# Altium project COMS0005_Coms_Test_Board.PrjPCB
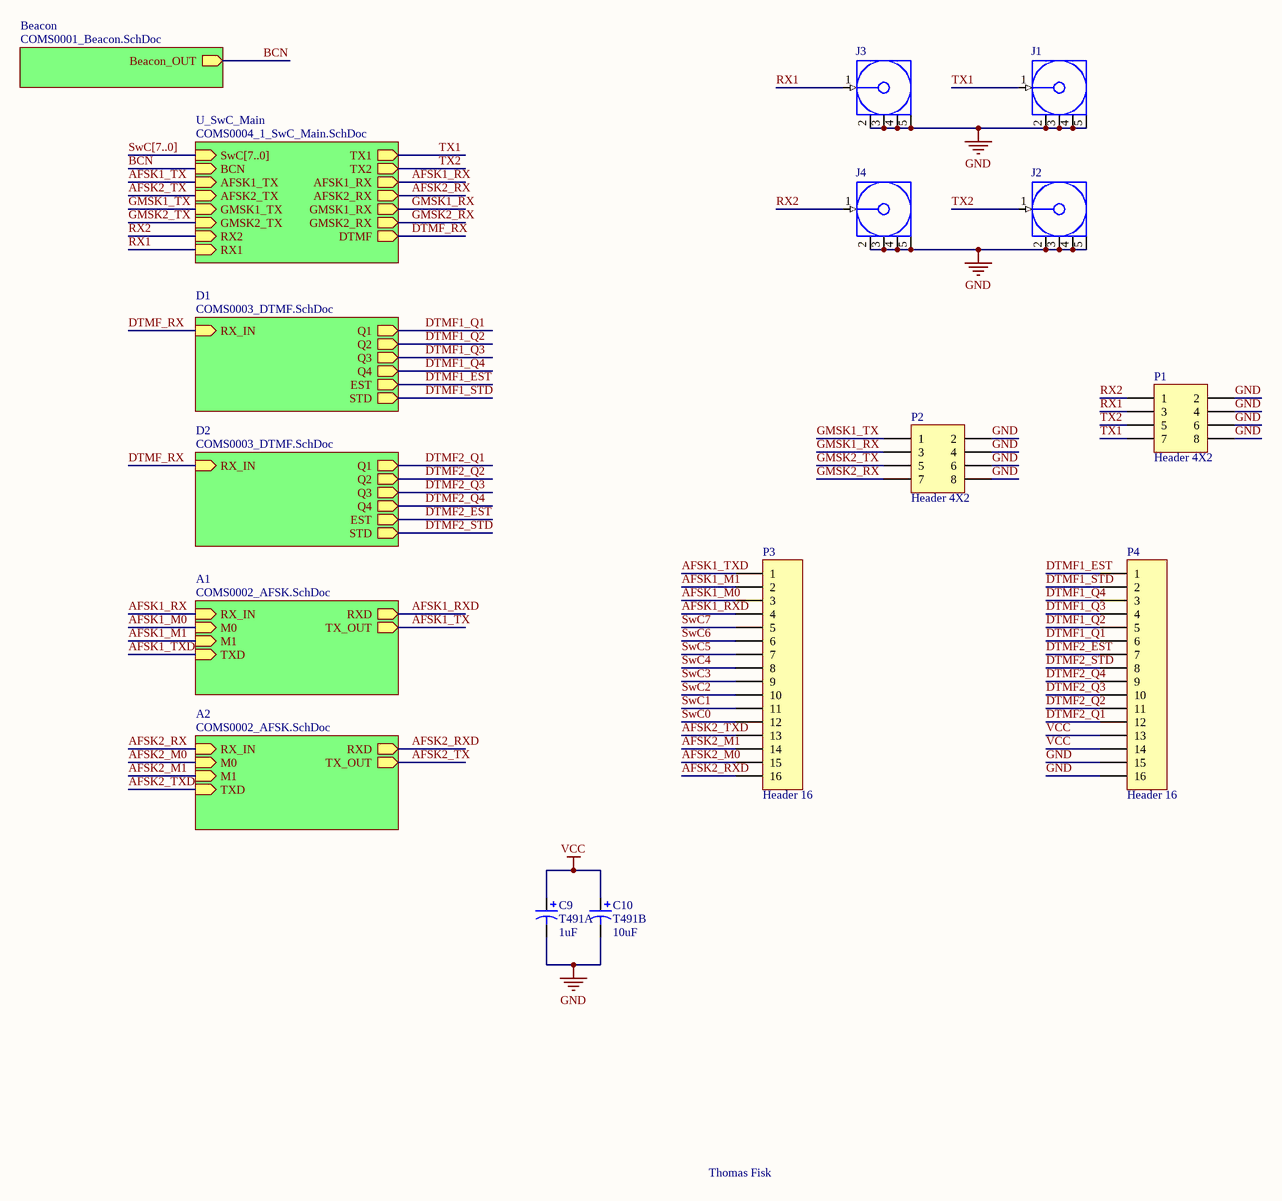
[diagram p0: COMS0005_Comms_Test_Board.SchDoc]
8 sheets, 74 parts. Net scope: hierarchical (ports join the sheet entries above them; power ports are global).
Board file: COMS0005_Coms_Test_Board.PcbDoc
Sheets:
  COMS0005_Comms_Test_Board.SchDoc
    Beacon = COMS0001_Beacon.SchDoc
    D1 = COMS0003_DTMF.SchDoc
    D2 = COMS0003_DTMF.SchDoc
    A1 = COMS0002_AFSK.SchDoc
    A2 = COMS0002_AFSK.SchDoc
    U_SwC_Main = COMS0004_1_SwC_Main.SchDoc
      U_ModemRXMux = COMS0004_4_ModemRXMux.SchDoc
      U_TXDevMux = COMS0004_2_TXDevMux.SchDoc
      U_RadioMux = COMS0004_3_RadioMux.SchDoc

## Sheet COMS0005_Comms_Test_Board.SchDoc: BLUEsat Communications Test Board
size A3; DrawnBy: Thomas Fisk; Engineer: T. FISK; Organization: BLUEsat Project; Address1: Room 419; Address2: School of EE&T; Address3: UNSW, NSW 2052; Address4: Australia; DocumentNumber: COMS0005; SheetNumber: 1; SheetTotal: 1; Description: Test board for communications subsystem.; Version: 1.0

### Parts
C9  T491A  value 1uF  [A]
C10  T491B  value 10uF  [B]
J1  TX1  [SMB_V-RJ45]  (value not drawn)
J2  TX2  [SMB_V-RJ45]  (value not drawn)
J3  RX2  [SMB_V-RJ45]  (value not drawn)
J4  RX1  [SMB_V-RJ45]  (value not drawn)
P1  Header 4X2  [HDR2X4]
P2  Header 4X2  [HDR2X4]
P3  Header 16  [HDR1X16]
P4  Header 16  [HDR1X16]

### Sub-sheets
A1 = COMS0002_AFSK.SchDoc: RX_IN (in), M0 (in), M1 (in), TXD (in), RXD (out), TX_OUT (out)
A2 = COMS0002_AFSK.SchDoc: RX_IN (in), M0 (in), M1 (in), TXD (in), RXD (out), TX_OUT (out)
Beacon = COMS0001_Beacon.SchDoc: Beacon_OUT (out)
D1 = COMS0003_DTMF.SchDoc: RX_IN (in), STD (out), EST (out), Q1 (out), Q2 (out), Q3 (out), Q4 (out)
D2 = COMS0003_DTMF.SchDoc: RX_IN (in), STD (out), EST (out), Q1 (out), Q2 (out), Q3 (out), Q4 (out)
U_SwC_Main = COMS0004_1_SwC_Main.SchDoc: SwC[7..0] (in), BCN (in), AFSK1_TX (in), AFSK2_TX (in), GMSK1_TX (in), GMSK2_TX (in), TX1 (out), TX2 (out), RX2 (in), RX1 (in), AFSK1_RX (out), AFSK2_RX (out), GMSK1_RX (out), GMSK2_RX (out), DTMF (out)

### Nets
GND: C9.2 C10.2 J1.2(GND) J1.3(GND) J1.4(GND) J1.5(GND) J2.2(GND) J2.3(GND) J2.4(GND) J2.5(GND) J3.2(GND) J3.3(GND) J3.4(GND) J3.5(GND) J4.2(GND) J4.3(GND) J4.4(GND) J4.5(GND) P1.2 P1.4 P1.6 P1.8 P2.2 P2.4 P2.6 P2.8 P4.15 P4.16
VCC: C9.1 C10.1 P4.13 P4.14
AFSK1_M0: P3.3 ; sheet A1/M0
AFSK1_M1: P3.2 ; sheet A1/M1
AFSK1_RX: sheet A1/RX_IN, sheet U_SwC_Main/AFSK1_RX
AFSK1_RXD: P3.4 ; sheet A1/RXD
AFSK1_TX: sheet A1/TX_OUT, sheet U_SwC_Main/AFSK1_TX
AFSK1_TXD: P3.1 ; sheet A1/TXD
AFSK2_M0: P3.15 ; sheet A2/M0
AFSK2_M1: P3.14 ; sheet A2/M1
AFSK2_RX: sheet A2/RX_IN, sheet U_SwC_Main/AFSK2_RX
AFSK2_RXD: P3.16 ; sheet A2/RXD
AFSK2_TX: sheet A2/TX_OUT, sheet U_SwC_Main/AFSK2_TX
AFSK2_TXD: P3.13 ; sheet A2/TXD
BCN: sheet Beacon/Beacon_OUT, sheet U_SwC_Main/BCN  [project net AF]
DTMF1_EST: P4.1 ; sheet D1/EST
DTMF1_Q1: P4.6 ; sheet D1/Q1
DTMF1_Q2: P4.5 ; sheet D1/Q2
DTMF1_Q3: P4.4 ; sheet D1/Q3
DTMF1_Q4: P4.3 ; sheet D1/Q4
DTMF1_STD: P4.2 ; sheet D1/STD
DTMF2_EST: P4.7 ; sheet D2/EST
DTMF2_Q1: P4.12 ; sheet D2/Q1
DTMF2_Q2: P4.11 ; sheet D2/Q2
DTMF2_Q3: P4.10 ; sheet D2/Q3
DTMF2_Q4: P4.9 ; sheet D2/Q4
DTMF2_STD: P4.8 ; sheet D2/STD
DTMF_RX: sheet D1/RX_IN, sheet D2/RX_IN, sheet U_SwC_Main/DTMF
GMSK1_RX: P2.3 ; sheet U_SwC_Main/GMSK1_RX
GMSK1_TX: P2.1 ; sheet U_SwC_Main/GMSK1_TX
GMSK2_RX: P2.7 ; sheet U_SwC_Main/GMSK2_RX
GMSK2_TX: P2.5 ; sheet U_SwC_Main/GMSK2_TX
RX1: J3.1(Signal) P1.3 ; sheet U_SwC_Main/RX1
RX2: J4.1(Signal) P1.1 ; sheet U_SwC_Main/RX2
SwC0: P3.12
SwC1: P3.11
SwC2: P3.10
SwC3: P3.9
SwC4: P3.8
SwC5: P3.7
SwC6: P3.6
SwC7: P3.5
TX1: J1.1(Signal) P1.7 ; sheet U_SwC_Main/TX1
TX2: J2.1(Signal) P1.5 ; sheet U_SwC_Main/TX2

### Buses and harness runs
bus SwC[7..0] = sheet U_SwC_Main/SwC[7..0]

### Notes on the sheet
- Thomas Fisk
- Title
- Description:
- Size:
- Author:
- Date:
- A3
- Time:
- Version
- Sheet:
- Drawing No.:
- of
- File:

### Library data of the parts
C9 = T491A: Solid Tantalum Chip Capacitor, Standard T491 Series - Industrial Grade; Published: 17-Jul-2002; LatestRevisionDate: 19-Mar-2004; LatestRevisionNote: Silkscreen dimensions re-sized.; DatasheetDocument: Mar-2001; PackageDocument: Mar-2001; PackageReference: A; Publisher: Altium Limited; Code_JEITA: 3216-18; ComponentLink1Description: Manufacturer Link; ComponentLink1URL: http://www.kemet.com/; ComponentLink2Description: Datasheet; ComponentLink2URL: http://www.kemet.com/kemet/web/homepage/kechome.nsf/vapubfilesname/F3102TA.pdf/$file/F3102TA.pdf
C10 = T491B: Solid Tantalum Chip Capacitor, Standard T491 Series - Industrial Grade; Published: 17-Jul-2002; LatestRevisionDate: 19-Mar-2004; LatestRevisionNote: Silkscreen dimensions re-sized.; DatasheetDocument: Mar-2001; PackageDocument: Mar-2001; PackageReference: B; Publisher: Altium Limited; Code_JEITA: 3528-21; ComponentLink1Description: Manufacturer Link; ComponentLink1URL: http://www.kemet.com/; ComponentLink2Description: Datasheet; ComponentLink2URL: http://www.kemet.com/kemet/web/homepage/kechome.nsf/vapubfilesname/F3102TA.pdf/$file/F3102TA.pdf
J1-J4 = COAX-F: RF Coaxial PCB Connector, MCX; Thru-Hole, Right-Angle Mount Socket, Blunt Post Terminal, 50 Ohm Impedance; pin to pad: 3>2 4>2 5>2; PCB_Layout: Complies with manufacturer's recommendation.; DrillSize: Corresponds to nominal value.; Published: 15-Jul-2004; LatestRevisionDate: 15-Jul-2004; LatestRevisionNote: Component Replaced.; DatasheetDocument: 30-May-2003; PackageDocument: 04-Jul-1999; PackageReference: 919-119J-51AX; Publisher: Altium Limited; ComponentLink1Description: Manufacturer Link; ComponentLink1URL: http://www.amphenolrf.com/
P1 P2 = Header 4X2: Header, 4-Pin, Dual row; LatestRevisionDate: 17-Jul-2002; LatestRevisionNote: Re-released for DXP Platform.; Publisher: Altium Limited
P3 P4 = Header 16: Header, 16-Pin; LatestRevisionDate: 17-Jul-2002; LatestRevisionNote: Re-released for DXP Platform.; Publisher: Altium Limited

## Sheet COMS0001_Beacon.SchDoc: BLUEsat Beacon
size A3; Author: Daniel Jedrychowski; Engineer: D. JEDRYCHOWSKI; Organization: BLUEsat Project; Address1: Room 419; Address2: School of EE&T; Address3: UNSW, NSW 2052; Address4: Australia; DocumentNumber: COMS0001; SheetNumber: 1; SheetTotal: 1; Description: Morse code continuous wave beacon based on EPROM; Version: 1.1
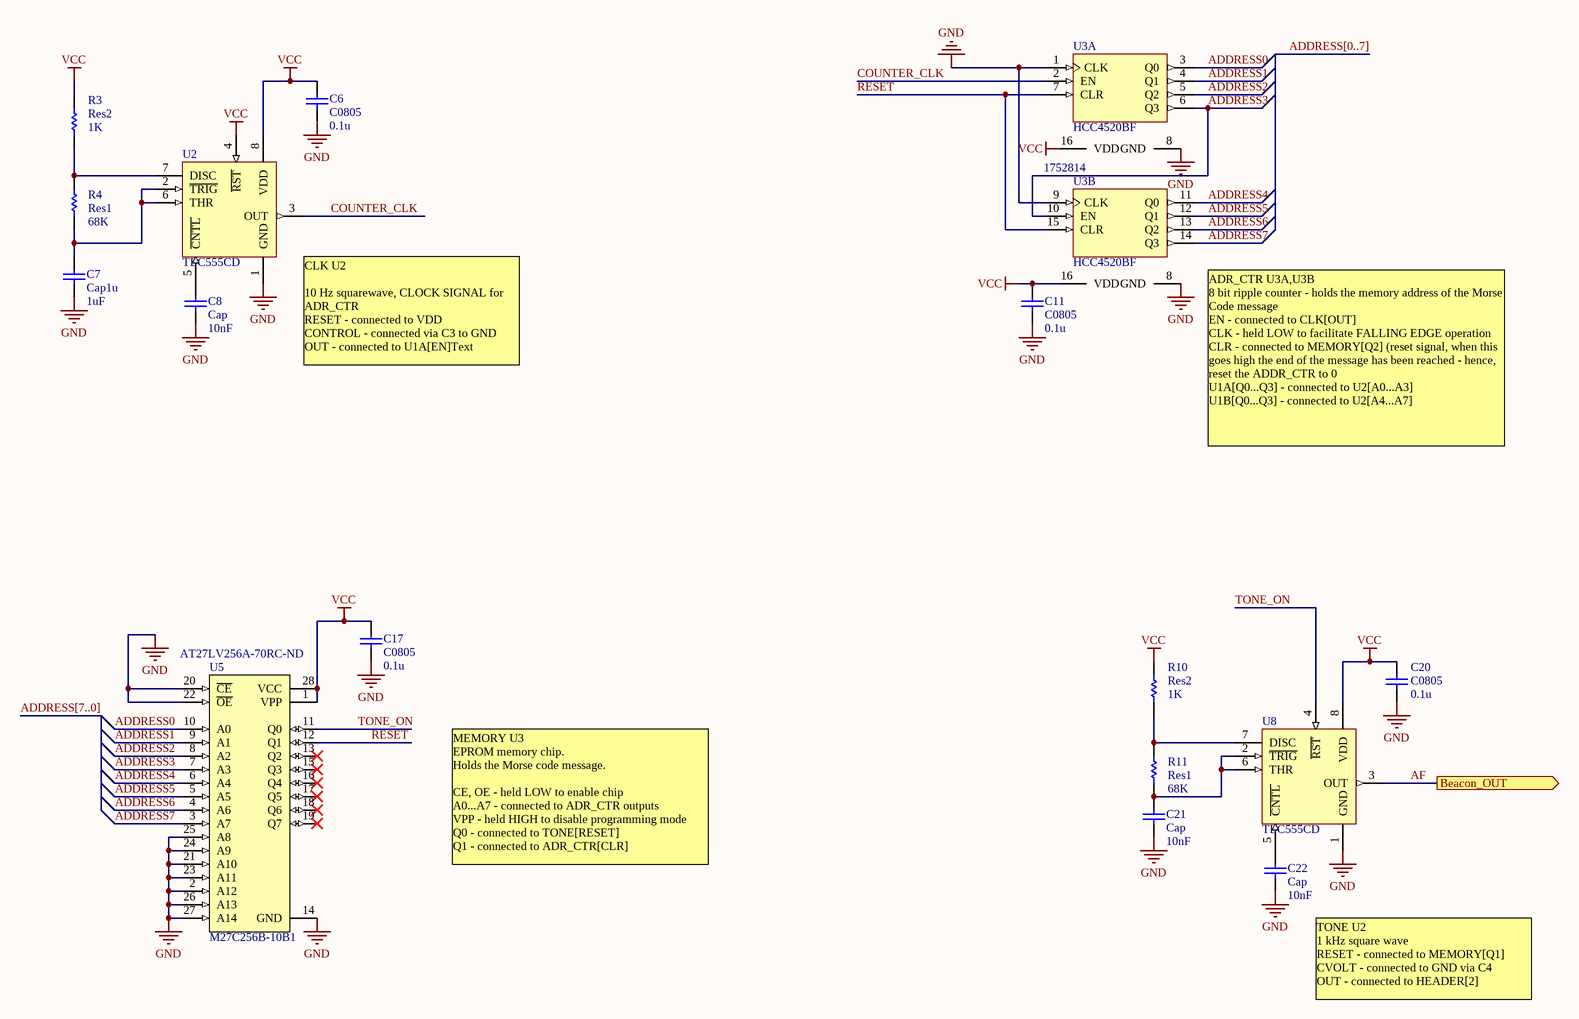
[diagram p1: COMS0001_Beacon.SchDoc]

### Parts
C6  C0805  value 0.1u  [CAPC2012M]
C7  Cap1u  value 1uF  [CAPC2012M]
C8  Cap  value 10nF  [CAPC2012M]
C11  C0805  value 0.1u  [CAPC2012M]
C17  C0805  value 0.1u  [CAPC2012M]
C20  C0805  value 0.1u  [CAPC2012M]
C21  Cap  value 10nF  [CAPC2012M]
C22  Cap  value 10nF  [CAPC2012M]
R3  Res2  value 1K  [RESC2012M]
R4  Res1  value 68K  [RESC2012M]
R10  Res2  value 1K  [RESC2012M]
R11  Res1  value 68K  [RESC2012M]
U2  TLC555CD  [D008_M]
U3  HCC4520BF  [SOIC16_M]  (parts A,B of 2)
U5  M27C256B-10B1  Supplier Part Number 1: AT27LV256A-70RC-ND  [SOIC127P1199-28AM]
U8  TLC555CD  [D008_M]

### Ports
Beacon_OUT (out)

### Nets
GND: C6.1 C7.1 C8.1 C11.1 C17.1 C20.1 C21.1 C22.1 U2.1(GND) U3.1(CLK) U3.8(GND) U3.9(CLK) U5.2(A12) U5.14(GND) U5.20(~{CE}) U5.21(A10) U5.22(~{OE}) U5.23(A11) U5.24(A9) U5.25(A8) U5.26(A13) U5.27(A14) U8.1(GND)
VCC: C6.2 C11.2 C17.2 C20.2 R3.2 R10.2 U2.4(~{RST}) U2.8(VDD) U3.16(VDD) U5.1(VPP) U5.28(VCC) U8.8(VDD)
ADDRESS0: U3.3(Q0) U5.10(A0)
ADDRESS1: U3.4(Q1) U5.9(A1)
ADDRESS2: U3.5(Q2) U5.8(A2)
ADDRESS3: U3.6(Q3) U3.10(EN) U5.7(A3)
ADDRESS4: U3.11(Q0) U5.6(A4)
ADDRESS5: U3.12(Q1) U5.5(A5)
ADDRESS6: U3.13(Q2) U5.4(A6)
ADDRESS7: U3.14(Q3) U5.3(A7)
AF: U8.3(OUT) ; port Beacon_OUT
COUNTER_CLK: U2.3(OUT) U3.2(EN)
RESET: U3.7(CLR) U3.15(CLR) U5.12(Q1)
TONE_ON: U5.11(Q0) U8.4(~{RST})
NetC7_2: C7.2 R4.1 U2.2(~{TRIG}) U2.6(THR)
NetC8_2: C8.2 U2.5(~{CNTL})
NetC21_2: C21.2 R11.1 U8.2(~{TRIG}) U8.6(THR)
NetC22_2: C22.2 U8.5(~{CNTL})
NetR3_1: R3.1 R4.2 U2.7(DISC)
NetR10_1: R10.1 R11.2 U8.7(DISC)

Not connected (* = marked no-connect by the designer): U5 13(Q2)* 15(Q3)* 16(Q4)* 17(Q5)* 18(Q6)* 19(Q7)*

### Buses and harness runs
bus ADDRESS[0..7]
bus ADDRESS[7..0]

### Notes on the sheet
- (near U2) CLK U2
  10 Hz squarewave, CLOCK SIGNAL for ADR_CTR
  RESET - connected to VDD
  CONTROL - connected via C3 to GND
  OUT - connected to U1A[EN]Text
- (near U3) ADR_CTR U3A,U3B
  8 bit ripple counter - holds the memory address of the Morse Code message
  EN - connected to CLK[OUT]
  CLK - held LOW to facilitate FALLING EDGE operation
  CLR - connected to MEMORY[Q2] (reset signal, when this goes high the end of the message has been reached - hence, reset the ADDR_CTR to 0
  U1A[Q0...Q3] - connected to U2[A0...A3]
  U1B[Q0...Q3] - connected to U2[A4...A7]
- MEMORY U3
  EPROM memory chip.
  Holds the Morse code message.
  CE, OE - held LOW to enable chip
  A0...A7 - connected to ADR_CTR outputs
  VPP - held HIGH to disable programming mode
  Q0 - connected to TONE[RESET]
  Q1 - connected to ADR_CTR[CLR]
- TONE U2
  1 kHz square wave
  RESET - connected to MEMORY[Q1]
  CVOLT - connected to GND via C4
  OUT - connected to HEADER[2]
- Title
- Description:
- Size:
- Author:
- Date:
- A3
- Time:
- Version
- Sheet:
- Drawing No.:
- of
- File:

### Library data of the parts
C6-C8 C11 C17 C20-C22 = Cap: Capacitor; Published: 8-Jun-2000; LatestRevisionDate: 17-Jul-2002; LatestRevisionNote: Re-released for DXP Platform.; PackageReference: RAD-0.3; Publisher: Altium Limited; Supplier 1: Farnell
  C6 C11 C17 C20: Supplier Part Number 1: 1650866
  C7: Supplier Part Number 1: 1637035
  C8 C21 C22: Supplier Part Number 1: 9406352
R3 R4 R10 R11 = Res1: Resistor; Published: 8-Jun-2000; LatestRevisionDate: 17-Jul-2002; LatestRevisionNote: Re-released for DXP Platform.; PackageReference: AXIAL-0.3; Publisher: Altium Limited; Supplier 1: Farnell
  R3 R10: Supplier Part Number 1: 1500663
  R4 R11: Supplier Part Number 1: 9234233
U2 U8 = TLC555CD: LinCMOS Timer; Published: 15-Apr-2002; LatestRevisionDate: 13-Apr-2006; LatestRevisionNote: IPC-7351 Footprint Added.; DatasheetVersion: Oct-1988; PackageVersion: Jan-1998; PackageReference: D008; Publisher: Altium Limited; PackageDescription: 8-Pin Small Outline Integrated Circuit 1.27 mm Pitch; Code_IPC: SOIC127P600-8; ComponentLink1Description: Manufacturer Link; ComponentLink1URL: http://www.ti.com/; ComponentLink2Description: Datasheet; ComponentLink2URL: http://www-s.ti.com/sc/ds/tlc555.pdf; Supplier 1: Farnell; Supplier Part Number 1: 1575195
  U2: Supplier 2: Farnell
  U8: Supplier 2: Mouser
U3 = HCC4520BF: Dual Binary Up-Counter; Published: 8-Jun-2000; LatestRevisionDate: 06-Jun-2005; LatestRevisionNote: Stylized 3D Model Added.; DatasheetVersion: Jun-1989; PackageVersion: Apr-1996; PackageReference: DIP16; Publisher: Altium Limited; PackageDescription: DIP; 16 Leads; Row Spacing 7.62 mm; Pitch 2.54 mm; ComponentLink1Description: Manufacturer Link; ComponentLink1URL: http://www.st.com/; Supplier 1: Farnell; Supplier Part Number 1: 1752814; Supplier 2: Farnell
U5 = M27C256B-10B1: 256 Kbit (32Kb X 8) UV EPROM and OTP EPROM; Published: 24-Aug-2001; LatestRevisionDate: 06-Jun-2005; LatestRevisionNote: Stylized 3D Model Added.; DatasheetVersion: Jul-1998; PackageVersion: Jan-2003; PackageReference: PDIP28; Publisher: Altium Limited; PackageDescription: DIP; 28 Leads; Row Spacing 15.24 mm; Pitch 2.54 mm; ComponentLink1Description: Manufacturer Link; ComponentLink1URL: http://www.st.com/; ComponentLink2Description: Datasheet; ComponentLink2URL: http://www.st.com/stonline/products/literature/ds/2384/m27c256b.pdf; Supplier 1: Digi-Key

## Sheet COMS0003_DTMF.SchDoc: BLUEsat DTMF receiver
size A3; DrawnBy: Thomas Fisk; Engineer: T. FISK; Organization: BLUEsat Project; Address1: Room 419; Address2: School of EE&T; Address3: UNSW, NSW 2052; Address4: Australia; DocumentNumber: COMS0003; SheetNumber: 1; SheetTotal: 1; Description: DTMF Reciever based on Zarlink MT88L70 IC; Version: 1.0
Used 2 times, as channels D1, D2. Parts and nets are listed once, with the designators drawn on the sheet.
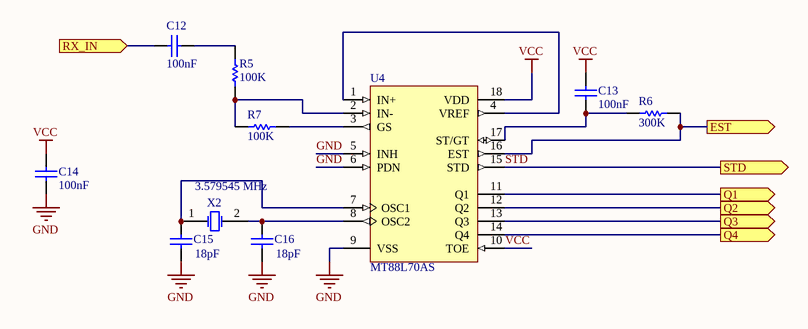
[diagram p2: COMS0003_DTMF.SchDoc]

### Parts
C12  value 100nF  [CAPC2012M]  (hidden comment: Cap)
C13  value 100nF  [CAPC2012M]  (hidden comment: Cap)
C14  value 100nF  [CAPC2012M]  (hidden comment: Cap)
C15  value 18pF  [CAPC2012M]  (hidden comment: Cap)
C16  value 18pF  [CAPC2012M]  (hidden comment: Cap)
R5  value 100K  [RESC2012M]  (hidden comment: Res1)
R6  value 300K  [RESC2012M]  (hidden comment: Res1)
R7  value 100K  [RESC2012M]  (hidden comment: Res1)
U4  MT88L70AS  [SOIC18_N]
X2  3.579545 MHz  [CSM-7]

### Ports
EST (out), Q1 (out), Q2 (out), Q3 (out), Q4 (out), RX_IN (in), STD (out)

### Nets
GND: C14.2 C15.2 C16.2 U4.5(INH) U4.6(PDN) U4.9(VSS)
VCC: C13.2 C14.1 U4.10(TOE) U4.18(VDD)
EST: R6.1 U4.16(EST) ; port EST
Q1: U4.11(Q1) ; port Q1
Q2: U4.12(Q2) ; port Q2
Q3: U4.13(Q3) ; port Q3
Q4: U4.14(Q4) ; port Q4
RX_IN: C12.2 ; port RX_IN
STD: U4.15(STD) ; port STD
NetC12_1: C12.1 R5.2
NetC13_1: C13.1 R6.2 U4.17(ST/GT)
NetC15_1: C15.1 U4.7(OSC1) X2.1(OSC1)
NetC16_1: C16.1 U4.8(OSC2) X2.2(OSC2)
NetR5_1: R5.1 R7.2 U4.2(IN-)
NetR7_1: R7.1 U4.3(GS)
NetU4_1: U4.1(IN+) U4.4(VREF)

### Channels
D1: designators end in _D1; ports EST=DTMF1_EST Q1=DTMF1_Q1 Q2=DTMF1_Q2 Q3=DTMF1_Q3 Q4=DTMF1_Q4 RX_IN=DTMF_RX STD=DTMF1_STD
D2: designators end in _D2; ports EST=DTMF2_EST Q1=DTMF2_Q1 Q2=DTMF2_Q2 Q3=DTMF2_Q3 Q4=DTMF2_Q4 RX_IN=DTMF_RX STD=DTMF2_STD

### Notes on the sheet
- Title
- Description:
- Size:
- Author:
- Date:
- A3
- Time:
- Version
- Sheet:
- Drawing No.:
- of
- File:

### Library data of the parts
C12-C16 = Cap: Capacitor; Published: 8-Jun-2000; LatestRevisionDate: 17-Jul-2002; LatestRevisionNote: Re-released for DXP Platform.; PackageReference: RAD-0.3; Publisher: Altium Limited; PackageDescription: Radial Cap, Thru-Hole; 2 Leads; 0.3 in Pin Spacing; Supplier 1: Farnell; Supplier Part Number 1: 1759143
R5-R7 = Res1: Resistor; Published: 8-Jun-2000; LatestRevisionDate: 17-Jul-2002; LatestRevisionNote: Re-released for DXP Platform.; PackageReference: AXIAL-0.3; Publisher: Altium Limited; PackageDescription: Axial Device, Thru-Hole; 2 Leads; 0.3 in Pin Spacing; Supplier 1: Farnell
  R5 R7: Supplier Part Number 1: 1759143RL; Supplier 2: Farnell; Supplier Part Number 2: 1887334
  R6: Supplier Part Number 1: 1887346
U4 = MT88L70AS: 3 Volt Integrated DTMF Receiver; Published: 8-Jun-2000; LatestRevisionDate: 13-Apr-2006; LatestRevisionNote: IPC-7351 Footprint Added.; DatasheetVersion: Issue 4 March 1997; PackageVersion: 1997; PackageReference: SOIC18; Publisher: Altium Limited; PackageDescription: 18-Pin Small Outline Integrated Circuit 1.27 mm Pitch; Code_JEDEC: MS-013-AB; ComponentLink1Description: Manufacturer Link; ComponentLink1URL: http://products.zarlink.com; ComponentLink2Description: Datasheet; ComponentLink2URL: http://assets.zarlink.com/DS/zarlink_MT88L70_MAY_05.pdf; Supplier 1: Allied; Supplier Part Number 1: 090-SPEC
X2 = ECS-110-S-5P: Crystal Oscillator; Published: 17-Jul-2002; DatasheetDocument: 18-Apr-2000; PackageReference: CSM-7; Publisher: Altium Limited; ComponentLink1Description: Manufacturer Link; ComponentLink1URL: http://www.ecsxtal.com/; ComponentLink2Description: Datasheet; ComponentLink2URL: http://www.ecsxtal.com/pdf3/CSM_7.pdf; Supplier 1: Farnell; Supplier Part Number 1: 1079073

## Sheet COMS0002_AFSK.SchDoc: BLUEsat AFSK Modem
size A3; DrawnBy: Mitch Wenke, Chris Webb, Thomas Fisk; Engineer: C. WEBB, M. WENKE; Organization: BLUEsat Project; Address1: Room 419; Address2: School of EE&T; Address3: UNSW, NSW 2052; Address4: Australia; DocumentNumber: COMS0002; SheetNumber: 1; SheetTotal: 1; Description: AFSK modem based on CML MX614 IC; Version: 1.0
Used 2 times, as channels A1, A2. Parts and nets are listed once, with the designators drawn on the sheet.
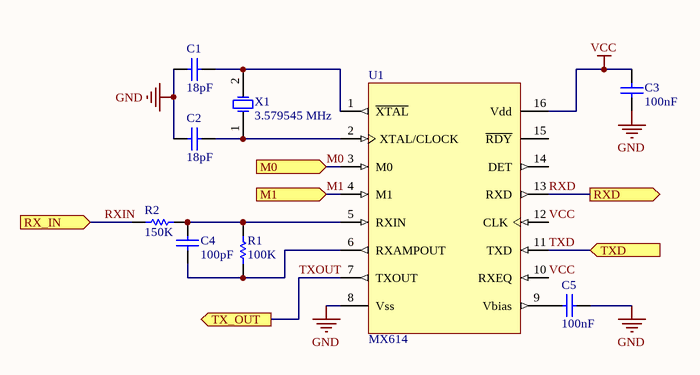
[diagram p3: COMS0002_AFSK.SchDoc]

### Parts
C1  value 18pF  [CAPC2012M]  (hidden comment: Cap)
C2  value 18pF  [CAPC2012M]  (hidden comment: Cap)
C3  value 100nF  [CAPC2012M]  (hidden comment: Cap)
C4  value 100pF  [CAPC2012M]  (hidden comment: Cap)
C5  value 100nF  [CAPC2012M]  (hidden comment: Cap)
R1  value 100K  [RESC2012M]  (hidden comment: Res1)
R2  value 150K  [RESC2012M]  (hidden comment: Res1)
U1  MX614  [SOIC127P1030X270-16N]
X1  3.579545 MHz  [CSM-7]

### Ports
M0 (in), M1 (in), RX_IN (in), RXD (out), TX_OUT (out), TXD (in)

### Nets
GND: C1.1 C2.1 C3.2 C5.1 U1.8(Vss)
VCC: C3.1 U1.10(RXEQ) U1.12(CLK) U1.16(Vdd)
M0: U1.3(M0) ; port M0
M1: U1.4(M1) ; port M1
RXD: U1.13(RXD) ; port RXD
RXIN: R2.1 ; port RX_IN
TXD: U1.11(TXD) ; port TXD
TXOUT: U1.7(TXOUT) ; port TX_OUT
NetC1_2: C1.2 U1.1(~{XTAL}) X1.2(OSC2)
NetC2_2: C2.2 U1.2(XTAL/CLOCK) X1.1(OSC1)
NetC4_1: C4.1 R1.1 U1.6(RXAMPOUT)
NetC4_2: C4.2 R1.2 R2.2 U1.5(RXIN)
NetC5_2: C5.2 U1.9(Vbias)

Not connected (* = marked no-connect by the designer): U1 14(DET) 15(~{RDY})

### Channels
A1: designators end in _A1; ports M0=AFSK1_M0 M1=AFSK1_M1 RX_IN=AFSK1_RX RXD=AFSK1_RXD TX_OUT=AFSK1_TX TXD=AFSK1_TXD
A2: designators end in _A2; ports M0=AFSK2_M0 M1=AFSK2_M1 RX_IN=AFSK2_RX RXD=AFSK2_RXD TX_OUT=AFSK2_TX TXD=AFSK2_TXD

### Notes on the sheet
- Title
- Description:
- Size:
- Author:
- Date:
- A3
- Time:
- Version
- Sheet:
- Drawing No.:
- of
- File:

### Library data of the parts
C1-C5 = Cap: Capacitor; Published: 8-Jun-2000; LatestRevisionDate: 17-Jul-2002; LatestRevisionNote: Re-released for DXP Platform.; PackageReference: RAD-0.3; Publisher: Altium Limited; Supplier 1: Farnell
  C1-C3 C5: PackageDescription: Radial Cap, Thru-Hole; 2 Leads; 0.3 in Pin Spacing; Supplier Part Number 1: 1759143
  C4: Supplier Part Number 1: 1759203
R1 R2 = Res1: Resistor; Published: 8-Jun-2000; LatestRevisionDate: 17-Jul-2002; LatestRevisionNote: Re-released for DXP Platform.; PackageReference: AXIAL-0.3; Publisher: Altium Limited
  R1: PackageDescription: Axial Device, Thru-Hole; 2 Leads; 0.3 in Pin Spacing; Supplier 1: Farnell; Supplier Part Number 1: 1759143RL; Supplier 2: Farnell; Supplier Part Number 2: 1887334
U1 = MX614: Bell 202 Compatible Modem; Published: 17-Jul-2002; LatestRevisionDate: 04-Mar-2005; LatestRevisionNote: Stylized 3D Model Added.; DatasheetVersion: Nov-2000; PackageVersion: pkg_32, Aug-2005; PackageReference: PDIP16; Publisher: Altium Limited; PackageDescription: DIP; 16 Leads; Row Spacing 7.62 mm; Pitch 2.54 mm; Code_JEDEC: MS-001-BB; ComponentLink1Description: Manufacturer Link; ComponentLink1URL: http://www.latticesemi.com/products/ispPAC/80/index.cfm; ComponentLink2Description: Datasheet; ComponentLink2URL: http://www.latticesemi.com/account/_download.cfm?AMID=1252; ComponentLink3Description: Lattice Login; ComponentLink3URL: http://www.latticesemi.com/account/login.cfm
X1 = ECS-110-S-5P: Crystal Oscillator; Published: 17-Jul-2002; DatasheetDocument: 18-Apr-2000; PackageReference: CSM-7; Publisher: Altium Limited; ComponentLink1Description: Manufacturer Link; ComponentLink1URL: http://www.ecsxtal.com/; ComponentLink2Description: Datasheet; ComponentLink2URL: http://www.ecsxtal.com/pdf3/CSM_7.pdf; Supplier 1: Farnell; Supplier Part Number 1: 1079073

## Sheet COMS0004_1_SwC_Main.SchDoc: BLUEsat Switching Circuit Overview
size A3; Engineer: D. JEDRYCHOWSKI; Organization: BLUEsat Project; Address1: Room 419; Address2: School of EE&T; Address3: UNSW, NSW 2052; Address4: Australia; DocumentNumber: COM0004; SheetNumber: 1; SheetTotal: 4; Description: Overview of Switching Circuit; Version: 1.0
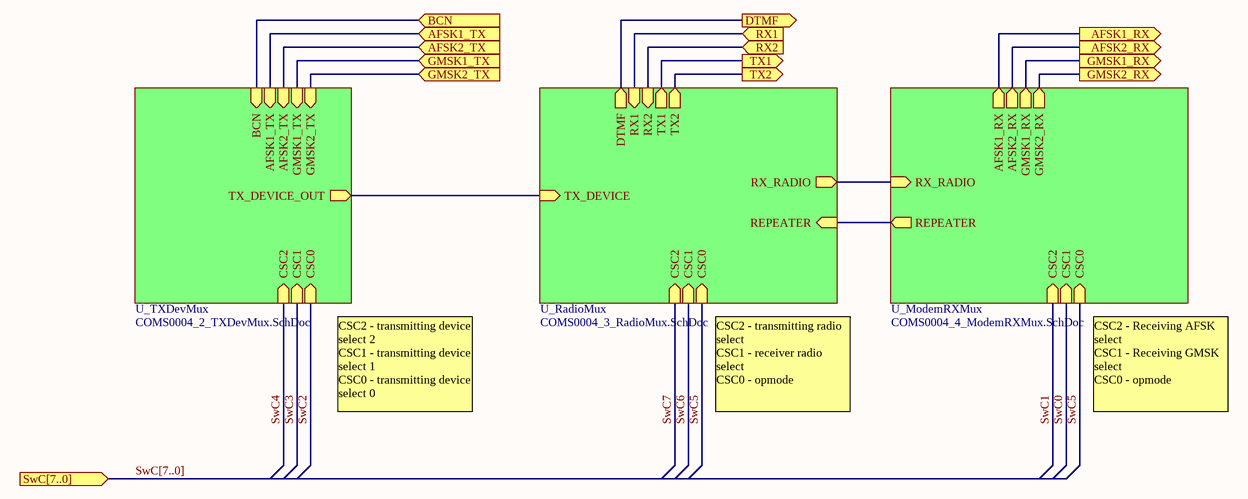
[diagram p4: COMS0004_1_SwC_Main.SchDoc]

### Sub-sheets
U_ModemRXMux = COMS0004_4_ModemRXMux.SchDoc: RX_RADIO (in), REPEATER (out), AFSK1_RX (out), AFSK2_RX (out), GMSK1_RX (out), GMSK2_RX (out), CSC2 (in), CSC1 (in), CSC0 (in)
U_RadioMux = COMS0004_3_RadioMux.SchDoc: RX_RADIO (out), RX1 (in), RX2 (in), TX1 (out), TX2 (out), TX_DEVICE (in), REPEATER (in), CSC2 (in), CSC1 (in), CSC0 (in), DTMF (out)
U_TXDevMux = COMS0004_2_TXDevMux.SchDoc: CSC2 (in), BCN (in), AFSK1_TX (in), AFSK2_TX (in), GMSK1_TX (in), GMSK2_TX (in), TX_DEVICE_OUT (out), CSC1 (in), CSC0 (in)

### Ports
AFSK1_RX (out), AFSK1_TX (in), AFSK2_RX (out), AFSK2_TX (in), BCN (in), DTMF (out), GMSK1_RX (out), GMSK1_TX (in), GMSK2_RX (out), GMSK2_TX (in), RX1 (in), RX2 (in), SwC[7..0] (in), TX1 (out), TX2 (out)

### Nets
AF: port BCN, sheet U_TXDevMux/BCN
AFSK1_RX: port AFSK1_RX, sheet U_ModemRXMux/AFSK1_RX
AFSK1_TX: port AFSK1_TX, sheet U_TXDevMux/AFSK1_TX
AFSK2_RX: port AFSK2_RX, sheet U_ModemRXMux/AFSK2_RX
AFSK2_TX: port AFSK2_TX, sheet U_TXDevMux/AFSK2_TX
DTMF_RX: port DTMF, sheet U_ModemRXMux/RX_RADIO, sheet U_RadioMux/RX_RADIO, sheet U_RadioMux/DTMF
GMSK1_RX: port GMSK1_RX, sheet U_ModemRXMux/GMSK1_RX
GMSK1_TX: port GMSK1_TX, sheet U_TXDevMux/GMSK1_TX
GMSK2_RX: port GMSK2_RX, sheet U_ModemRXMux/GMSK2_RX
GMSK2_TX: port GMSK2_TX, sheet U_TXDevMux/GMSK2_TX
RX1: port RX1, sheet U_RadioMux/RX1
RX2: port RX2, sheet U_RadioMux/RX2
SwC5: sheet U_ModemRXMux/CSC0, sheet U_RadioMux/CSC0
TX1: port TX1, sheet U_RadioMux/TX1
TX2: port TX2, sheet U_RadioMux/TX2
NetU6_3: sheet U_ModemRXMux/REPEATER, sheet U_RadioMux/REPEATER
NetU7_5: sheet U_TXDevMux/TX_DEVICE_OUT, sheet U_RadioMux/TX_DEVICE

### Buses and harness runs
bus SwC[7..0] = port SwC[7..0]

### Notes on the sheet
- CSC2 - transmitting device select 2
  CSC1 - transmitting device select 1
  CSC0 - transmitting device select 0
- CSC2 - transmitting radio select
  CSC1 - receiver radio select
  CSC0 - opmode
- CSC2 - Receiving AFSK select
  CSC1 - Receiving GMSK select
  CSC0 - opmode
- Title
- Description:
- Size:
- Author:
- Date:
- A3
- Time:
- Version
- Sheet:
- Drawing No.:
- of
- File:

## Sheet COMS0004_4_ModemRXMux.SchDoc: BLUEsat Switching Circuit
size A3; Engineer: D. JEDRYCHOWSKI; Organization: BLUEsat Project; Address1: Room 419; Address2: School of EE&T; Address3: UNSW, NSW 2052; Address4: Australia; DocumentNumber: COMS0004; SheetNumber: 4; SheetTotal: 4; Description: Selects the GMSK and AFSK modems to be used for reception; Version: 1.0
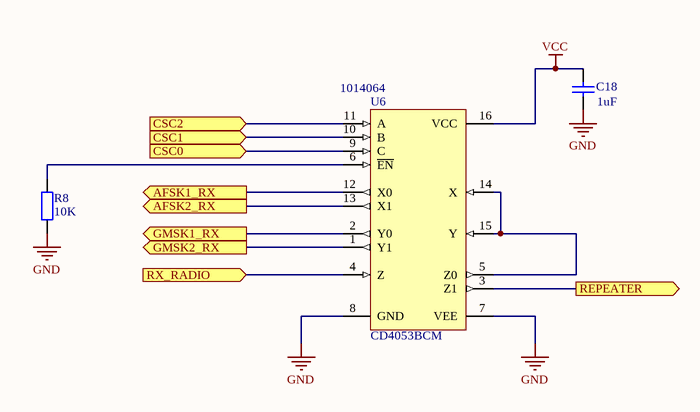
[diagram p5: COMS0004_4_ModemRXMux.SchDoc]

### Parts
C18  value 1uF  [0805]  (hidden comment: C1210)
R8  value 10K  [RESC2012N]  (hidden comment: Res1)
U6  CD4053BCM  Supplier Part Number 1: 1014064  [M16A_M]

### Ports
AFSK1_RX (out), AFSK2_RX (out), CSC0 (in), CSC1 (in), CSC2 (in), GMSK1_RX (out), GMSK2_RX (out), REPEATER (out), RX_RADIO (in)

### Nets
GND: C18.1 R8.1 U6.7(VEE) U6.8(GND)
VCC: C18.2 U6.16(VCC)
AFSK1_RX: U6.12(X0) ; port AFSK1_RX
AFSK2_RX: U6.13(X1) ; port AFSK2_RX
DTMF_RX: U6.4(Z) ; port RX_RADIO
GMSK1_RX: U6.2(Y0) ; port GMSK1_RX
GMSK2_RX: U6.1(Y1) ; port GMSK2_RX
SwC0: U6.10(B) ; port CSC1
SwC1: U6.11(A) ; port CSC2
SwC5: U6.9(C) ; port CSC0
NetR8_2: R8.2 U6.6(~{EN})
NetU6_3: U6.3(Z1) ; port REPEATER
NetU6_5: U6.5(Z0) U6.14(X) U6.15(Y)

### Notes on the sheet
- Title
- Description:
- Size:
- Author:
- Date:
- A3
- Time:
- Version
- Sheet:
- Drawing No.:
- of
- File:

### Library data of the parts
C18 = Cap: Capacitor; Published: 8-Jun-2000; LatestRevisionDate: 17-Jul-2002; LatestRevisionNote: Re-released for DXP Platform.; PackageReference: RAD-0.3; Publisher: Altium Limited; PackageDescription: Radial Cap, Thru-Hole; 2 Leads; 0.3 in Pin Spacing; Supplier 1: Farnell; Supplier Part Number 1: 1637035
R8 = Res2: Resistor; Published: 8-Jun-2000; LatestRevisionDate: 17-Jul-2002; LatestRevisionNote: Re-released for DXP Platform.; PackageReference: AXIAL-0.4; Publisher: Altium Limited; PackageDescription: Axial Device, Thru-Hole; 2 Leads; 0.4 in Pin Spacing; Supplier 1: Farnell; Supplier Part Number 1: 1811779
U6 = CD4053BCM: Triple 2-Channnel Analog Multiplexer/Demutiplexer; Published: 17-Jul-2002; LatestRevisionDate: 13-Apr-2006; LatestRevisionNote: IPC-7351 Footprint Added.; DatasheetVersion: Jan-1999; PackageVersion: 2000; PackageReference: M16A; Publisher: Altium Limited; PackageDescription: 16-Pin Small Outline Integrated Circuit 1.27 mm Pitch; ComponentLink1Description: Manufacturer Link; ComponentLink1URL: http://www.fairchildsemi.com/; ComponentLink2Description: Datasheet; ComponentLink2URL: http://www.fairchildsemi.com/ds/CD%2FCD4052BC.pdf; Code_IPC: SOIC127P600-16; Supplier 1: Farnell

## Sheet COMS0004_2_TXDevMux.SchDoc: BLUEsat Switching Circuit
size A3; Engineer: D. JEDRYCHOWSKI; Organization: BLUEsat Project; Address1: Room 419; Address2: School of EE&T; Address3: UNSW, NSW 2052; Address4: Australia; DocumentNumber: COMS0004; SheetNumber: 2; SheetTotal: 4; Description: Selects the AFSK and GMSK modems for transmission; Version: 1.0
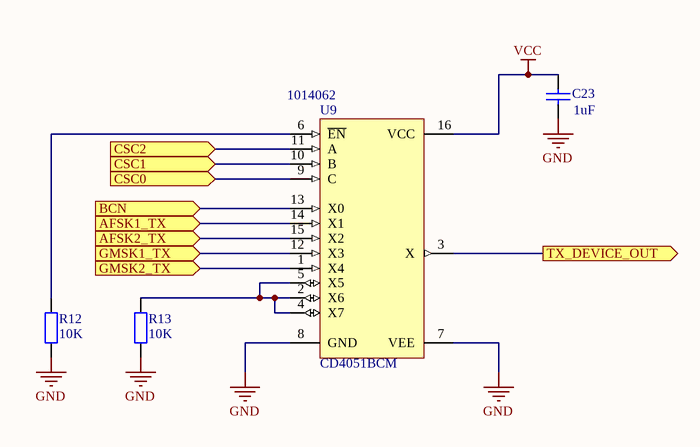
[diagram p6: COMS0004_2_TXDevMux.SchDoc]

### Parts
C23  value 1uF  [0805]  (hidden comment: C1210)
R12  value 10K  [RESC2012N]  (hidden comment: Res1)
R13  value 10K  [RESC2012N]  (hidden comment: Res1)
U9  CD4051BCM  Supplier Part Number 1: 1014062  [M16A_M]

### Ports
AFSK1_TX (in), AFSK2_TX (in), BCN (in), CSC0 (in), CSC1 (in), CSC2 (in), GMSK1_TX (in), GMSK2_TX (in), TX_DEVICE_OUT (out)

### Nets
GND: C23.1 R12.1 R13.1 U9.7(VEE) U9.8(GND)
VCC: C23.2 U9.16(VCC)
AF: U9.13(X0) ; port BCN
AFSK1_TX: U9.14(X1) ; port AFSK1_TX
AFSK2_TX: U9.15(X2) ; port AFSK2_TX
GMSK1_TX: U9.12(X3) ; port GMSK1_TX
GMSK2_TX: U9.1(X4) ; port GMSK2_TX
SwC2: U9.9(C) ; port CSC0
SwC3: U9.10(B) ; port CSC1
SwC4: U9.11(A) ; port CSC2
NetR12_2: R12.2 U9.6(~{EN})
NetR13_2: R13.2 U9.2(X6) U9.4(X7) U9.5(X5)
NetU7_5: U9.3(X) ; port TX_DEVICE_OUT

### Notes on the sheet
- Title
- Description:
- Size:
- Author:
- Date:
- A3
- Time:
- Version
- Sheet:
- Drawing No.:
- of
- File:

### Library data of the parts
C23 = Cap: Capacitor; Published: 8-Jun-2000; LatestRevisionDate: 17-Jul-2002; LatestRevisionNote: Re-released for DXP Platform.; PackageReference: RAD-0.3; Publisher: Altium Limited; PackageDescription: Radial Cap, Thru-Hole; 2 Leads; 0.3 in Pin Spacing; Supplier 1: Farnell; Supplier Part Number 1: 1637035
R12 R13 = Res2: Resistor; Published: 8-Jun-2000; LatestRevisionDate: 17-Jul-2002; LatestRevisionNote: Re-released for DXP Platform.; PackageReference: AXIAL-0.4; Publisher: Altium Limited; PackageDescription: Axial Device, Thru-Hole; 2 Leads; 0.4 in Pin Spacing; Supplier 1: Farnell; Supplier Part Number 1: 1811779
U9 = CD4051BCM: 8-Channel Analog Multiplexer/Demultiplexer; Published: 17-Jul-2002; LatestRevisionDate: 13-Apr-2006; LatestRevisionNote: IPC-7351 Footprint Added.; DatasheetVersion: Jan-1999; PackageVersion: 2000; PackageReference: M16A; Publisher: Altium Limited; PackageDescription: 16-Pin Small Outline Integrated Circuit 1.27 mm Pitch; ComponentLink1Description: Manufacturer Link; ComponentLink1URL: http://www.fairchildsemi.com/; ComponentLink2Description: Datasheet; ComponentLink2URL: http://www.fairchildsemi.com/ds/CD%2FCD4052BC.pdf; Code_IPC: SOIC127P600-16; Supplier 1: Farnell

## Sheet COMS0004_3_RadioMux.SchDoc: BLUEsat Switching Circuit
size A3; Engineer: D. JEDRYCHOWSKI; Organization: BLUEsat Project; Address1: Room 419; Address2: School of EE&T; Address3: UNSW, NSW 2052; Address4: Australia; DocumentNumber: COMS0004; SheetNumber: 3; SheetTotal: 4; Description: Selects the transmitter and reciever radios to be used; Version: 1.0
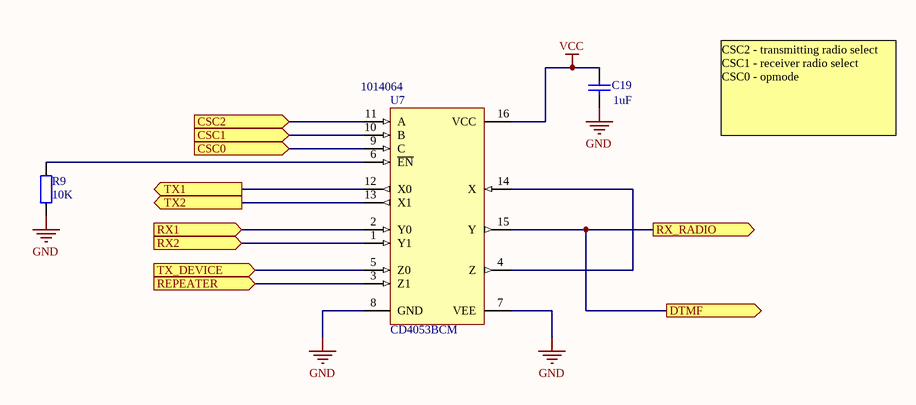
[diagram p7: COMS0004_3_RadioMux.SchDoc]

### Parts
C19  value 1uF  [0805]  (hidden comment: C1210)
R9  value 10K  [RESC2012N]  (hidden comment: Res1)
U7  CD4053BCM  Supplier Part Number 1: 1014064  [M16A_M]

### Ports
CSC0 (in), CSC1 (in), CSC2 (in), DTMF (out), REPEATER (in), RX1 (in), RX2 (in), RX_RADIO (out), TX1 (out), TX2 (out), TX_DEVICE (in)

### Nets
GND: C19.1 R9.2 U7.7(VEE) U7.8(GND)
VCC: C19.2 U7.16(VCC)
DTMF_RX: U7.15(Y) ; port RX_RADIO, port DTMF
RX1: U7.2(Y0) ; port RX1
RX2: U7.1(Y1) ; port RX2
SwC5: U7.9(C) ; port CSC0
SwC6: U7.10(B) ; port CSC1
SwC7: U7.11(A) ; port CSC2
TX1: U7.12(X0) ; port TX1
TX2: U7.13(X1) ; port TX2
NetR9_1: R9.1 U7.6(~{EN})
NetU6_3: U7.3(Z1) ; port REPEATER
NetU7_4: U7.4(Z) U7.14(X)
NetU7_5: U7.5(Z0) ; port TX_DEVICE

### Notes on the sheet
- CSC2 - transmitting radio select
  CSC1 - receiver radio select
  CSC0 - opmode
- Title
- Description:
- Size:
- Author:
- Date:
- A3
- Time:
- Version
- Sheet:
- Drawing No.:
- of
- File:

### Library data of the parts
C19 = Cap: Capacitor; Published: 8-Jun-2000; LatestRevisionDate: 17-Jul-2002; LatestRevisionNote: Re-released for DXP Platform.; PackageReference: RAD-0.3; Publisher: Altium Limited; PackageDescription: Radial Cap, Thru-Hole; 2 Leads; 0.3 in Pin Spacing; Supplier 1: Farnell; Supplier Part Number 1: 1637035
R9 = Res2: Resistor; Published: 8-Jun-2000; LatestRevisionDate: 17-Jul-2002; LatestRevisionNote: Re-released for DXP Platform.; PackageReference: AXIAL-0.4; Publisher: Altium Limited; PackageDescription: Axial Device, Thru-Hole; 2 Leads; 0.4 in Pin Spacing; Supplier 1: Farnell; Supplier Part Number 1: 1811779
U7 = CD4053BCM: as U6 on sheet COMS0004_4_ModemRXMux; Published: 17-Jul-2002; LatestRevisionDate: 13-Apr-2006; LatestRevisionNote: IPC-7351 Footprint Added.; DatasheetVersion: Jan-1999; PackageVersion: 2000; PackageReference: M16A; Publisher: Altium Limited; PackageDescription: 16-Pin Small Outline Integrated Circuit 1.27 mm Pitch; ComponentLink1Description: Manufacturer Link; ComponentLink1URL: http://www.fairchildsemi.com/; ComponentLink2Description: Datasheet; ComponentLink2URL: http://www.fairchildsemi.com/ds/CD%2FCD4052BC.pdf; Code_IPC: SOIC127P600-16; Supplier 1: Farnell

## Nets that join several sheets
GND: COMS0005_Comms_Test_Board (28 pins), COMS0001_Beacon (23 pins), D1 (6 pins), D2 (6 pins), A1 (5 pins), A2 (5 pins), COMS0004_4_ModemRXMux (C18.1 R8.1 U6.7 U6.8), COMS0004_2_TXDevMux (5 pins), COMS0004_3_RadioMux (C19.1 R9.2 U7.7 U7.8)
VCC: COMS0005_Comms_Test_Board (C9.1 C10.1 P4.13 P4.14), COMS0001_Beacon (12 pins), D1 (C13_D1.2 C14_D1.1 U4_D1.10 U4_D1.18), D2 (C13_D2.2 C14_D2.1 U4_D2.10 U4_D2.18), A1 (C3_A1.1 U1_A1.10 U1_A1.12 U1_A1.16), A2 (C3_A2.1 U1_A2.10 U1_A2.12 U1_A2.16), COMS0004_4_ModemRXMux (C18.2 U6.16), COMS0004_2_TXDevMux (C23.2 U9.16), COMS0004_3_RadioMux (C19.2 U7.16)
AF: COMS0001_Beacon (U8.3), COMS0004_2_TXDevMux (U9.13)
AFSK1_M0: COMS0005_Comms_Test_Board (P3.3), A1 (U1_A1.3)
AFSK1_M1: COMS0005_Comms_Test_Board (P3.2), A1 (U1_A1.4)
AFSK1_RX: A1 (R2_A1.1), COMS0004_4_ModemRXMux (U6.12)
AFSK1_RXD: COMS0005_Comms_Test_Board (P3.4), A1 (U1_A1.13)
AFSK1_TX: A1 (U1_A1.7), COMS0004_2_TXDevMux (U9.14)
AFSK1_TXD: COMS0005_Comms_Test_Board (P3.1), A1 (U1_A1.11)
AFSK2_M0: COMS0005_Comms_Test_Board (P3.15), A2 (U1_A2.3)
AFSK2_M1: COMS0005_Comms_Test_Board (P3.14), A2 (U1_A2.4)
AFSK2_RX: A2 (R2_A2.1), COMS0004_4_ModemRXMux (U6.13)
AFSK2_RXD: COMS0005_Comms_Test_Board (P3.16), A2 (U1_A2.13)
AFSK2_TX: A2 (U1_A2.7), COMS0004_2_TXDevMux (U9.15)
AFSK2_TXD: COMS0005_Comms_Test_Board (P3.13), A2 (U1_A2.11)
DTMF1_EST: COMS0005_Comms_Test_Board (P4.1), D1 (R6_D1.1 U4_D1.16)
DTMF1_Q1: COMS0005_Comms_Test_Board (P4.6), D1 (U4_D1.11)
DTMF1_Q2: COMS0005_Comms_Test_Board (P4.5), D1 (U4_D1.12)
DTMF1_Q3: COMS0005_Comms_Test_Board (P4.4), D1 (U4_D1.13)
DTMF1_Q4: COMS0005_Comms_Test_Board (P4.3), D1 (U4_D1.14)
DTMF1_STD: COMS0005_Comms_Test_Board (P4.2), D1 (U4_D1.15)
DTMF2_EST: COMS0005_Comms_Test_Board (P4.7), D2 (R6_D2.1 U4_D2.16)
DTMF2_Q1: COMS0005_Comms_Test_Board (P4.12), D2 (U4_D2.11)
DTMF2_Q2: COMS0005_Comms_Test_Board (P4.11), D2 (U4_D2.12)
DTMF2_Q3: COMS0005_Comms_Test_Board (P4.10), D2 (U4_D2.13)
DTMF2_Q4: COMS0005_Comms_Test_Board (P4.9), D2 (U4_D2.14)
DTMF2_STD: COMS0005_Comms_Test_Board (P4.8), D2 (U4_D2.15)
DTMF_RX: D1 (C12_D1.2), D2 (C12_D2.2), COMS0004_4_ModemRXMux (U6.4), COMS0004_3_RadioMux (U7.15)
GMSK1_RX: COMS0005_Comms_Test_Board (P2.3), COMS0004_4_ModemRXMux (U6.2)
GMSK1_TX: COMS0005_Comms_Test_Board (P2.1), COMS0004_2_TXDevMux (U9.12)
GMSK2_RX: COMS0005_Comms_Test_Board (P2.7), COMS0004_4_ModemRXMux (U6.1)
GMSK2_TX: COMS0005_Comms_Test_Board (P2.5), COMS0004_2_TXDevMux (U9.1)
NetU6_3: COMS0004_4_ModemRXMux (U6.3), COMS0004_3_RadioMux (U7.3)
NetU7_5: COMS0004_2_TXDevMux (U9.3), COMS0004_3_RadioMux (U7.5)
RX1: COMS0005_Comms_Test_Board (J3.1 P1.3), COMS0004_3_RadioMux (U7.2)
RX2: COMS0005_Comms_Test_Board (J4.1 P1.1), COMS0004_3_RadioMux (U7.1)
SwC0: COMS0005_Comms_Test_Board (P3.12), COMS0004_4_ModemRXMux (U6.10)
SwC1: COMS0005_Comms_Test_Board (P3.11), COMS0004_4_ModemRXMux (U6.11)
SwC2: COMS0005_Comms_Test_Board (P3.10), COMS0004_2_TXDevMux (U9.9)
SwC3: COMS0005_Comms_Test_Board (P3.9), COMS0004_2_TXDevMux (U9.10)
SwC4: COMS0005_Comms_Test_Board (P3.8), COMS0004_2_TXDevMux (U9.11)
SwC5: COMS0005_Comms_Test_Board (P3.7), COMS0004_4_ModemRXMux (U6.9), COMS0004_3_RadioMux (U7.9)
SwC6: COMS0005_Comms_Test_Board (P3.6), COMS0004_3_RadioMux (U7.10)
SwC7: COMS0005_Comms_Test_Board (P3.5), COMS0004_3_RadioMux (U7.11)
TX1: COMS0005_Comms_Test_Board (J1.1 P1.7), COMS0004_3_RadioMux (U7.12)
TX2: COMS0005_Comms_Test_Board (J2.1 P1.5), COMS0004_3_RadioMux (U7.13)